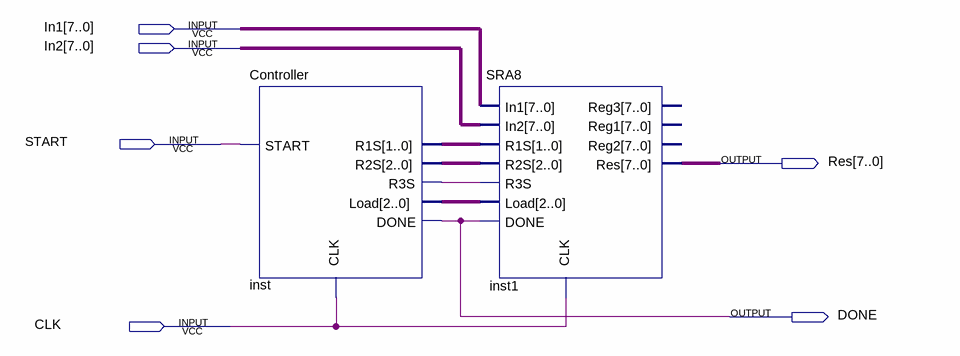
[diagram p0: schematic sheet]
// Quartus schematic Square.bdf as structural Verilog: 2 symbols, 6 pins
module Square (
  input  [7:0] In1,
  input  [7:0] In2,
  input  START,
  input  CLK,
  output [7:0] Res,
  output DONE
);

  wire inst_r3s;
  wire [1:0] inst_r1s;
  wire [2:0] inst_load, inst_r2s;

  Controller inst (
    .START(START), .CLK(CLK), .R1S(inst_r1s), .R2S(inst_r2s), .R3S(inst_r3s), .Load(inst_load), .DONE(DONE));
  SRA8 inst1 (
    .In1(In1), .In2(In2), .R1S(inst_r1s), .R2S(inst_r2s), .R3S(inst_r3s), .Load(inst_load), .DONE(DONE),
    .CLK(CLK), .Res(Res));  // open: Reg3, Reg1, Reg2
endmodule
